# EAGLE design Filter (EAGLE 9.3.1)
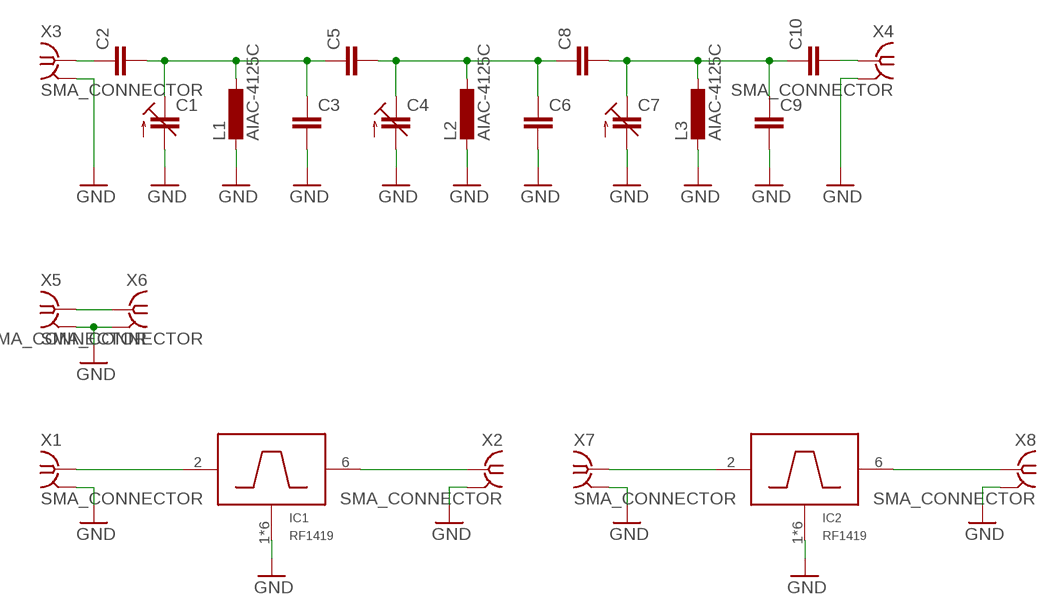
[diagram p0: schematic, sheet 1]

## Parts
C1  C-TRIMMCTZ3  [CTRIMCTZ3]
C2  C-EUC0603  [C0603]
C3  C-EUC0603  [C0603]
C4  C-TRIMMCTZ3  [CTRIMCTZ3]
C5  C-EUC0603  [C0603]
C6  C-EUC0603  [C0603]
C7  C-TRIMMCTZ3  [CTRIMCTZ3]
C8  C-EUC0603  [C0603]
C9  C-EUC0603  [C0603]
C10  C-EUC0603  [C0603]
IC1  RF1419  [RESCAV127P380X380X120-8]
IC2  RF1419  [RESCAV127P380X380X120-8]
L1  AIAC-4125C  [AIAC-4125C]
L2  AIAC-4125C  [AIAC-4125C]
L3  AIAC-4125C  [AIAC-4125C]
X1  SMA_CONNECTOR  [J502-ND-142-0711-821/826]
X2  SMA_CONNECTOR  [J502-ND-142-0711-821/826]
X3  SMA_CONNECTOR  [J502-ND-142-0711-821/826]
X4  SMA_CONNECTOR  [J502-ND-142-0711-821/826]
X5  SMA_CONNECTOR  [J502-ND-142-0711-821/826]
X6  SMA_CONNECTOR  [J502-ND-142-0711-821/826]
X7  SMA_CONNECTOR  [J502-ND-142-0711-821/826]
X8  SMA_CONNECTOR  [J502-ND-142-0711-821/826]

## Nets
GND: C1.2(A) C3.2 C4.2(A) C6.2 C7.2(A) C9.2 IC1.1(GND) IC1.3(GND) IC1.4(GND) IC1.5(GND) IC1.7(GND) IC1.8(GND) IC2.1(GND) IC2.3(GND) IC2.4(GND) IC2.5(GND) IC2.7(GND) IC2.8(GND) L1.P$2 L2.P$2 L3.P$2 X1.G@1 X1.G@2 X1.G@3 X1.G@4 X2.G@1 X2.G@2 X2.G@3 X2.G@4 X3.G@1 X3.G@2 X3.G@3 X3.G@4 X4.G@1 X4.G@2 X4.G@3 X4.G@4 X5.G@1 X5.G@2 X5.G@3 X5.G@4 X6.G@1 X6.G@2 X6.G@3 X6.G@4 X7.G@1 X7.G@2 X7.G@3 X7.G@4 X8.G@1 X8.G@2 X8.G@3 X8.G@4
N$1: C2.1 X3.1
N$2: IC1.2(IN) X1.1
N$3: IC1.6(OUT) X2.1
N$4: C1.1(E) C2.2 C3.1 C5.1 L1.P$1
N$5: C4.1(E) C5.2 C6.1 C8.1 L2.P$1
N$6: C7.1(E) C8.2 C9.1 C10.1 L3.P$1
N$7: C10.2 X4.1
N$8: X5.1 X6.1
N$10: IC2.2(IN) X7.1
N$11: IC2.6(OUT) X8.1

## Library data of the parts
C1 C4 C7 = rcl:C-TRIMM: Trimm capacitor
C2 C3 C5 C6 C8-C10 = rcl:C-EU: CAPACITOR, European symbol
IC1 IC2 = rf:RF1419
L1-L3 = rf:AIAC-4125C
X1-X8 = rf:SMA_CONNECTOR

## Board
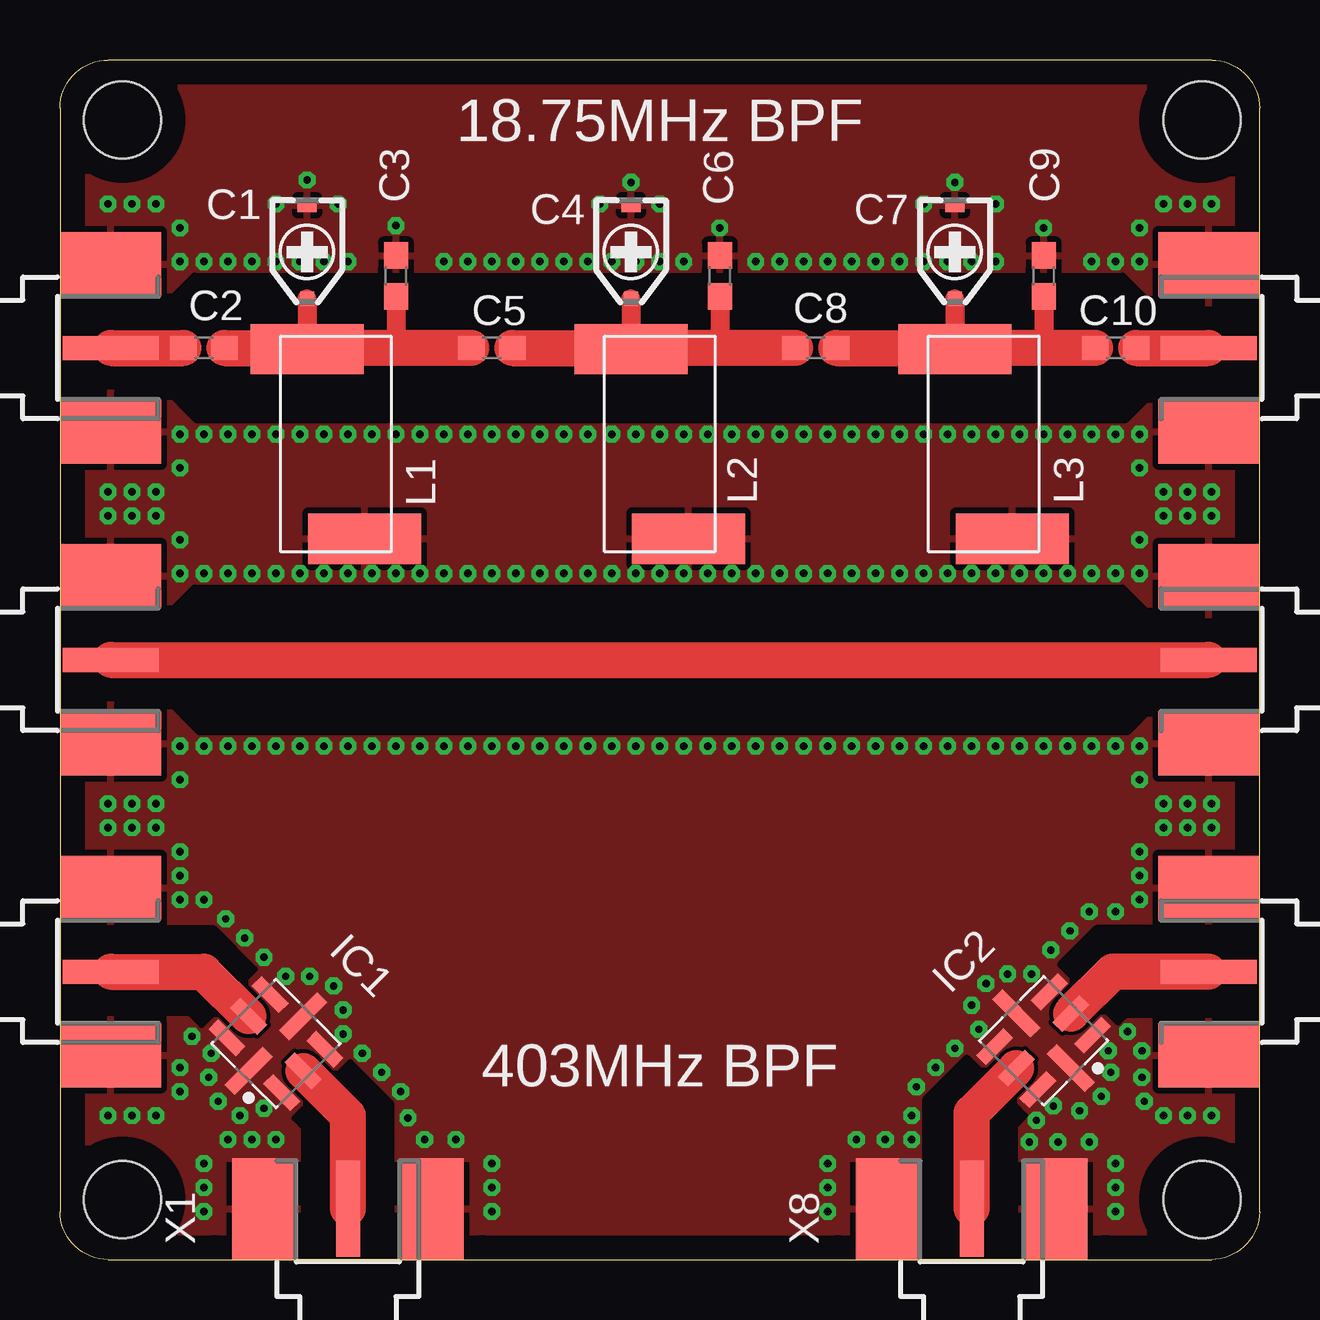
[diagram p1: board, top side]
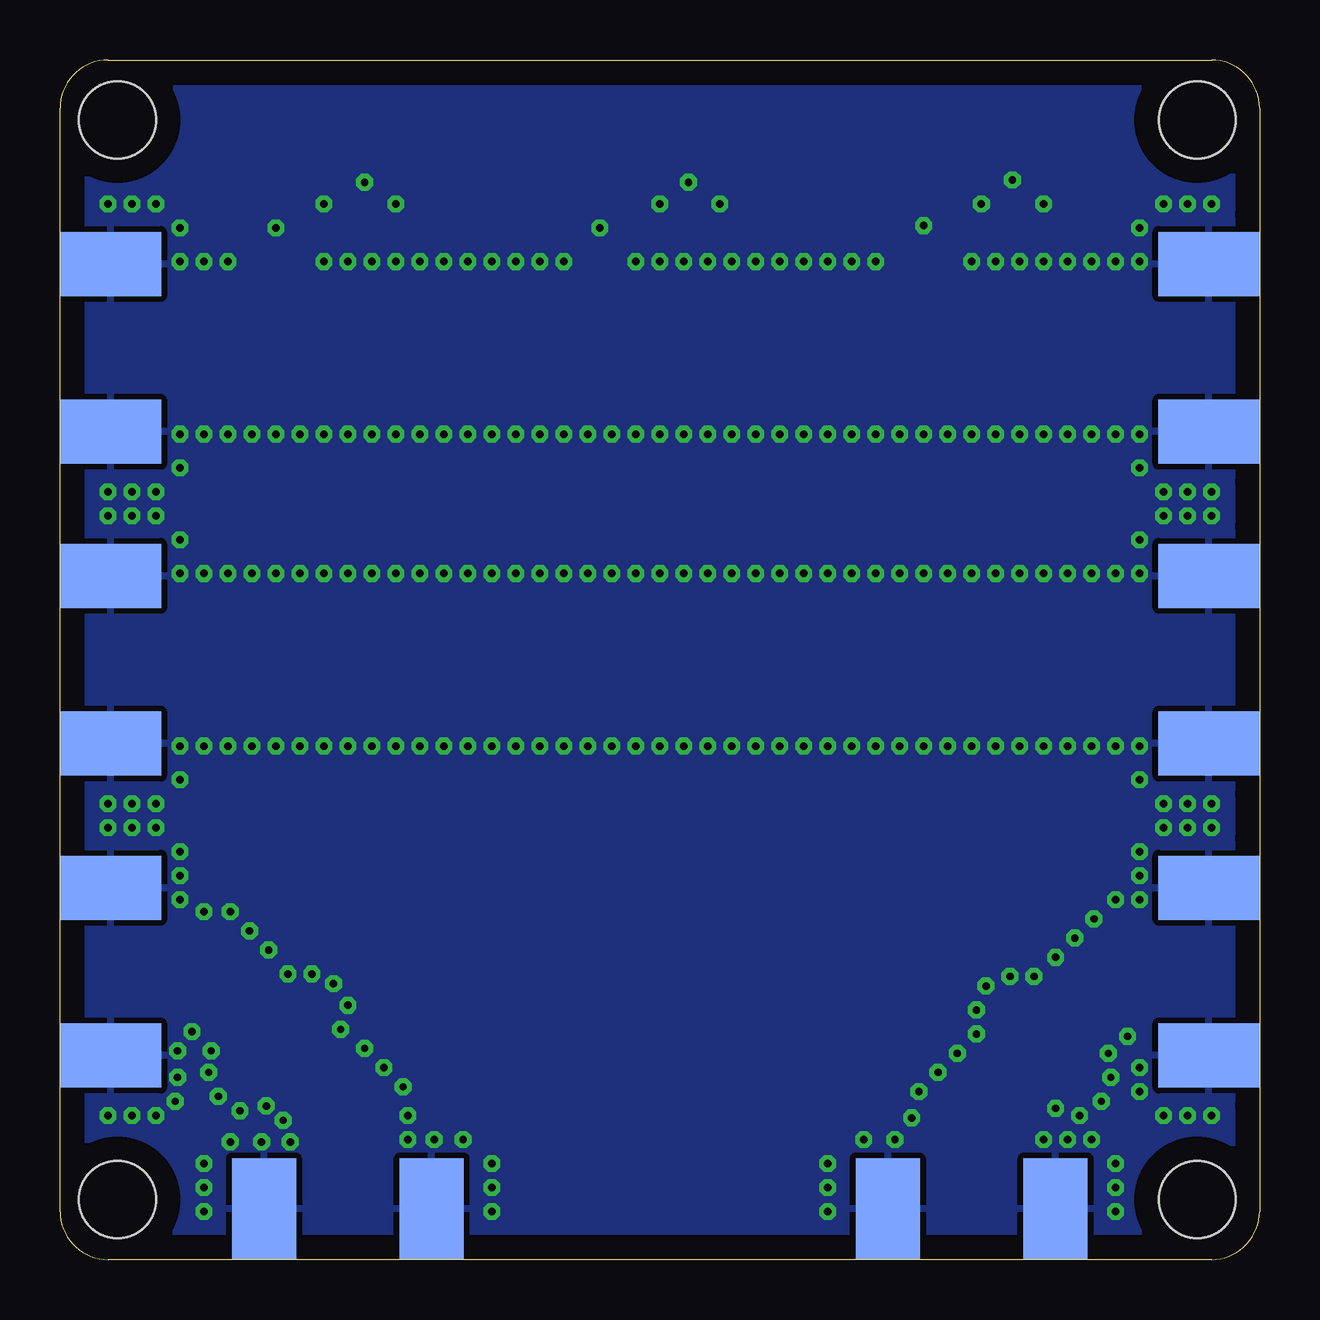
[diagram p2: board, bottom side, seen from below]

Size 50 x 50 mm. Coordinates in mm from the lower left corner, seen from the top.
Outline: 0,48 0,2 arc90 2,0 48,0 arc90 50,2 50,48 arc90 48,50 2,50 arc90 0,48
Copper layers (1*16): Top 0.035mm / dielectric 1.5mm / Bottom 0.035mm
Design rules "default *": minimum track width 6mil, minimum drill 0.3mm, track to track 6mil, track to pad 6mil, pad to pad 6mil, via to via 6mil, smd to smd 6mil, copper to edge 40mil, drill to drill 6mil, minimum pad ring 10mil, minimum via ring 8mil, stop-mask expansion 4mil, vias tented up to drill 0mil, thermal gap 10mil
Holes 3.2 mm at 2.6,47.5 47.6,47.5 47.6,2.5 2.6,2.5
tRestrict: 45 lines

### Footprints (pad centres in the part's own frame; a part is rotated, then mirrored left to right if it is on the bottom)
CTRIMCTZ3 = smd 0.6 x 0.6: 1 0,1.95 | smd 0.78 x 0.6: 2 0,-1.95
C0603 = smd 1.1 x 1: 1 -0.85,0; 2 0.85,0
RESCAV127P380X380X120-8 = smd 1.592 x 0.572: 1 -1.61,1.27; 2 -1.61,0; 3 -1.61,-1.27; 5 1.61,-1.27; 6 1.61,0; 7 1.61,1.27 | smd 0.572 x 2.242: 4 0,-1.61; 8 0,1.61
AIAC-4125C = smd 2.1 x 4.7: P$1 -3.95,-1.2; P$2 3.95,1.2
J502-ND-142-0711-821/826 = smd 4 x 1: 1 2.115,0 | smd 4.191 x 2.667: G@1 2.115,3.495; G@2 2.115,-3.495 | smd 4.191 x 2.667 bottom: G@3 2.115,3.495; G@4 2.115,-3.495

### Placement (x,y rotation side)
C1  10.3,42 180 top
C2  6,38 0 top
C3  14,41 90 top
C4  23.8,42 180 top
C5  18,38 0 top
C6  27.5,41 90 top
C7  37.3,42 180 top
C8  31.5,38 0 top
C9  41,41 90 top
C10  44,38 0 top
IC1  9,9 135 top
IC2  41,9.12 225 top
L1  11.5,34 270 top
L2  25,34 270 top
L3  38.5,34 270 top
X1  12,0 90 top
X2  0,12 0 top
X3  0,38 0 top
X4  50,38 180 top
X5  0,25 0 top
X6  50,25 180 top
X7  50,12 180 top
X8  38,0 90 top

### Tracks (layer width: path | path; a pad name or v marks a point on that pad's centre or on a via)
GND  (via drill 0.3)
  other vias: 6,34.4 7,34.4 8,34.4 9,34.4 10,34.4 11,34.4 12,34.4 13,34.4 14,34.4 15,34.4 16,34.4 17,34.4 18,34.4 19,34.4 20,34.4 21,34.4 22,34.4 23,34.4 24,34.4 25,34.4 26,34.4 27,34.4 28,34.4 29,34.4 30,34.4 31,34.4 32,34.4 33,34.4 34,34.4 35,34.4 36,34.4 37,34.4 38,34.4 39,34.4 40,34.4 41,34.4 42,34.4 43,34.4 44,34.4 16,41.6 17,41.6 18,41.6 19,41.6 20,41.6 21,41.6 22,41.6 23,41.6 24,41.6 25,41.6 26,41.6 29,41.6 30,41.6 31,41.6 32,41.6 33,41.6 34,41.6 35,41.6 36,41.6 37,41.6 38,41.6 39,41.6 43,41.6 44,41.6 12,41.6 11,41.6 10,41.6 9,41.6 6,41.6 8,41.6 7,41.6 6,28.6 7,28.6 8,28.6 9,28.6 10,28.6 11,28.6 12,28.6 13,28.6 14,28.6 15,28.6 16,28.6 17,28.6 18,28.6 19,28.6 20,28.6 21,28.6 22,28.6 23,28.6 24,28.6 25,28.6 26,28.6 27,28.6 28,28.6 29,28.6 30,28.6 31,28.6 32,28.6 33,28.6 34,28.6 35,28.6 36,28.6 37,28.6 38,28.6 39,28.6 40,28.6 41,28.6 42,28.6 43,28.6 44,28.6 6,21.4 7,21.4 8,21.4 9,21.4 10,21.4 11,21.4 12,21.4 13,21.4 14,21.4 15,21.4 16,21.4 17,21.4 18,21.4 19,21.4 20,21.4 21,21.4 22,21.4 23,21.4 24,21.4 25,21.4 26,21.4 27,21.4 28,21.4 29,21.4 30,21.4 31,21.4 32,21.4 33,21.4 34,21.4 35,21.4 36,21.4 37,21.4 38,21.4 39,21.4 40,21.4 41,21.4 42,21.4 43,21.4 44,21.4 5,34.4 5,33 4,32 3,32 2,32 2,31 3,31 4,31 5,30 5,28.6 5,41.6 5,43 4,44 3,44 2,44 48,44 47,44 46,44 45,43 45,41.6 41,43 37.3,44.9 39,44 36,44 27.5,43 23.8,44.9 25,44 22.5,44 14,43.1 10.3,45 11.6,44 9,44 45,34.4 45,33 46,32 47,32 48,32 48,31 47,31 46,31 45,30 45,28.6 45,21.4 45,20 46,19 47,19 48,19 5,21.4 5,20 4,19 3,19 2,19 2,18 3,18 4,18 5,17 5,16 5,15 6,15 6.9,14.2 7.7,13.4 8.5,12.6 9.4,11.8 10.4,11.8 11.4,11.4 11.8,10.4 11.8,9.4 12.6,8.6 13.4,7.8 14.2,7 14.5,5.9 15.2,5 16.5,5 18,4 18,3 18,2 6,2 6,3 6,4 7,5 8,5 9,5 8.5,6.3 6.6,6.6 7.5,6 6.3,8.6 5.5,9.3 5,8 5,7 4,6 3,6 2,6 6.2,7.6 48,18 47,18 46,18 45,17 45,16 45,15 44,14.5 42.9,14.5 42.1,13.7 41.3,12.9 40.5,11.9 38.6,11.5 39.5,11.9 38.3,9.6 38,10.6 37.3,8.8 36.5,8 35.7,7.2 35.5,6 35.5,5 34.4,5 33.2,5 32,4 32,3 32,2 44,2 44,3 44,4 40.4,4.9 41.6,4.9 42.9,4.9 41.4,6.4 43.4,6.8 42.5,6.2 40.7,5.8 43.7,8.7 43.8,7.8 44.5,9.5 45.1,8.7 45.1,7.6 48,6 47,6 46,6 45.2,6.6
  pour Top: -2,52.5 56,52.5 56,-4 -2,-4
  pour Bottom: -1.5,51.7 55.2,51.7 55.2,-2.9 -1.5,-2.9
  pour Top (no thermals): 5.7,16.3 45,16.3 45,4.2 5.7,4.2
N$1
  Top 1.5: X3.1 C2.1
N$2
  Top 1.5: X1.1 12,6 IC1.2
N$3
  Top 1.5: X2.1 6,12 IC1.6
N$4
  Top 0.8: C1.1 L1.P$1 | C3.1 14,38
  Top 1.5: C2.2 10.25,38 | 10.25,38 L1.P$1 | C5.1 14,38 10.25,38
N$5
  Top 0.8: C6.1 27.5,38 | C4.1 L2.P$1
  Top 1.5: C5.2 23.75,38 | 23.75,38 L2.P$1 | C8.1 27.5,38 23.75,38
N$6
  Top 0.8: C9.1 41,38.1 40.9,38 | C7.1 37.3,38.05 37.25,38
  Top 1.5: C8.2 37.25,38 | 37.25,38 L3.P$1 | C10.1 40.9,38 37.25,38
N$7
  Top 1.5: C10.2 X4.1
N$8
  Top 1.5: X5.1 X6.1
N$10
  Top 1.5: X7.1 43.88,12 IC2.2
N$11
  Top 1.5: X8.1 38,6.12 IC2.6

### Text on the board
tPlace: 18.75MHz BPF | 403MHz BPF